# Altium project WSN_Project_Sensor_node.PrjPcb
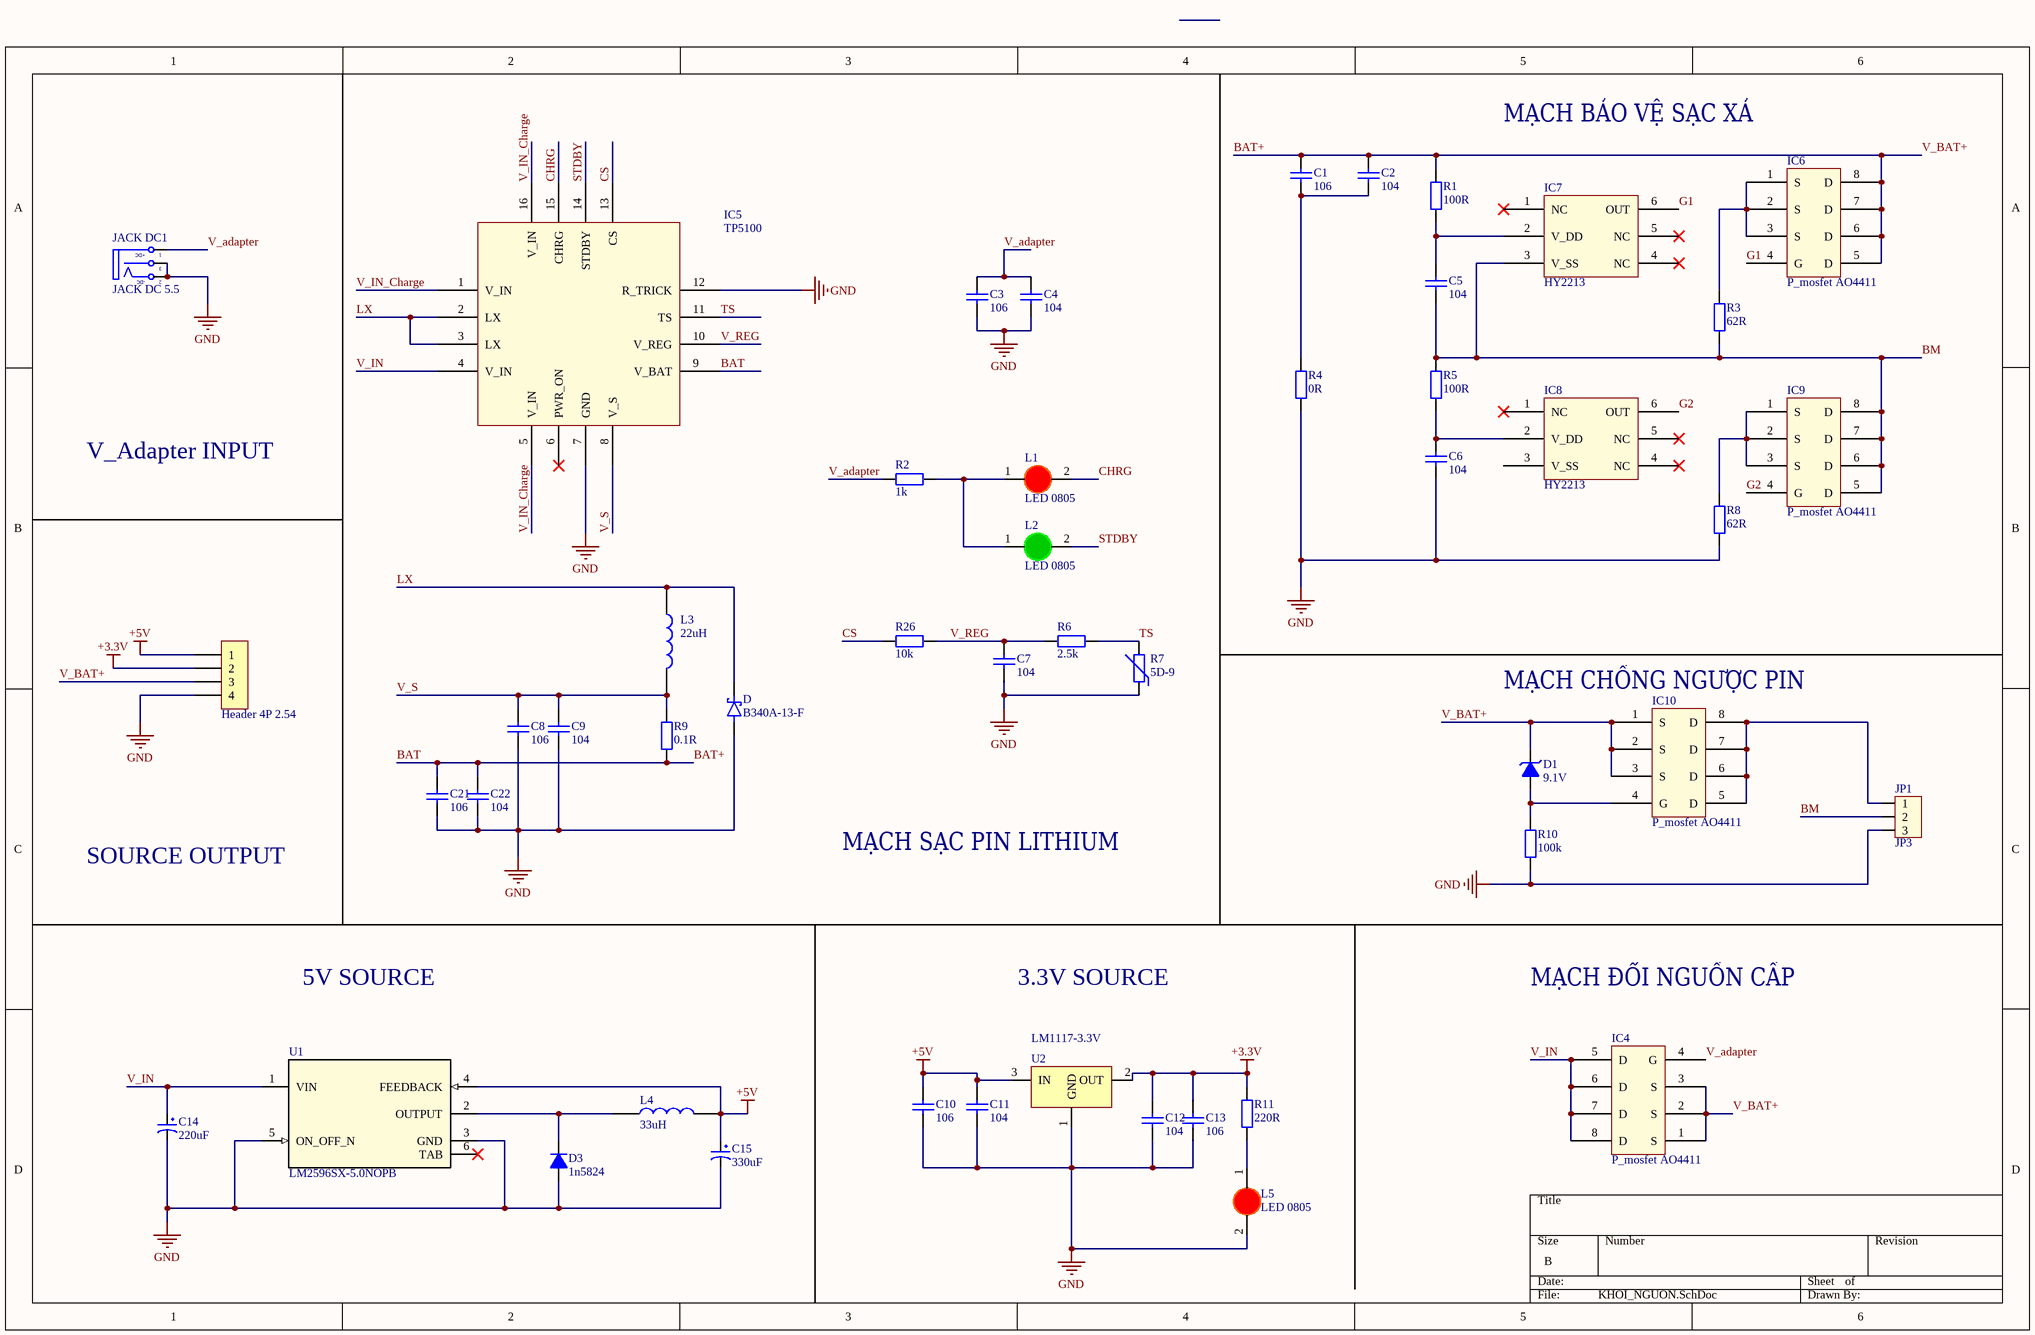
[diagram p0: KHOI_NGUON.SchDoc]
2 sheets, 83 parts. Net scope: global (net labels, ports and power ports of the same name join across sheets).
Sheets:
  KHOI_NGUON.SchDoc
  Sensor_node.SchDoc

## Sheet KHOI_NGUON.SchDoc
size B; SheetNumber: 1; SheetTotal: 2

### Parts
C1  106  [tu 1206]
C2  104  [tu 1206]
C3  106  [tu 1206]
C4  104  [tu 1206]
C5  104  [tu 1206]
C6  104  [tu 1206]
C7  104  [tu 1206]
C8  106  [tu 1206]
C9  104  [tu 1206]
C10  106  [tu 1206]
C11  104  [tu 1206]
C12  104  [tu 1206]
C13  106  [tu 1206]
C14  220uF  [tu hoa 6.5mm]
C15  330uF  [tu hoa 10mm]
C21  106  [tu 1206]
C22  104  [tu 1206]
D  B340A-13-F  [DIOM5226X240N]
D1  9.1V  [DIODE ZENNER SMD SOD80]
D3  1n5824  [DIODE 1A]
H1  Header 4P 2.54  [XH2.54M-4]
IC4  P_mosfet AO4411  [SOIC8_AO4411]
IC5  TP5100  [QFN_16_4*4]
IC6  P_mosfet AO4411  [SOIC8_AO4411]
IC7  HY2213  [SOT_23_6_HY2213]
IC8  HY2213  [SOT_23_6_HY2213]
IC9  P_mosfet AO4411  [SOIC8_AO4411]
IC10  P_mosfet AO4411  [SOIC8_AO4411]
JACK_DC1  JACK DC 5.5  [JACK DC 5.5]
JP1  JP3  [CON3]
L1  LED 0805  [LED-1206-Red]
L2  LED 0805  [LED-1206-Green]
L3  22uH  [Cuon Cam 12x12x10]
L4  33uH  [Cuon Cam 12x12x10]
L5  LED 0805  [LED-0805-Red]
R1  100R  [tro smd 0805]
R2  1k  [tro smd 0805]
R3  62R  [tro smd 0805]
R4  0R  [tro smd 0805]
R5  100R  [tro smd 0805]
R6  2.5k  [tro smd 0805]
R7  5D-9  [tro nhiet d-9]
R8  62R  [tro smd 0805]
R9  0.1R  [tro smd 2512]
R10  100k  [tro smd 0805]
R11  220R  [tro smd 0805]
R26  10k  [tro smd 0805]
U1  LM2596SX-5.0NOPB  [KTT0005B]
U2  LM1117-3.3V  [LM1117-SOP]

### Nets
+3.3V: C12.1 C13.2 H1.2 R11.1 U2.2(OUT)
+5V: C10.2 C11.1 C15.1 H1.1 L4.2 U1.4(FEEDBACK) U2.3(IN)
GND: C3.1 C4.2 C6.2 C7.2 C8.1 C9.2 C10.1 C11.2 C12.2 C13.1 C14.2 C15.2 C21.1 C22.2 D.A D3.1(A) H1.4 IC5.7(GND) IC5.12(R_TRICK) JACK_DC1.2(TN) JACK_DC1.3(S) JP1.3 L5.2(K) R4.1 R7.1 R8.1 R10.1 U1.3(GND) U1.5(ON_OFF_N) U2.1(GND)
BAT: C1.2 C2.1 C21.2 C22.1 D1.2(K) H1.3 IC4.1(S) IC4.2(S) IC4.3(S) IC5.9(V_BAT) IC6.5(D) IC6.6(D) IC6.7(D) IC6.8(D) IC10.1(S) IC10.2(S) IC10.3(S) R1.2 R9.1  [also labelled BAT+, V_BAT+]
BM: C5.2 IC7.3(V_SS) IC9.5(D) IC9.6(D) IC9.7(D) IC9.8(D) JP1.2 R3.1 R5.2
CHRG: IC5.15(CHRG) L1.2(K)
CS: IC5.13(CS) R26.2
G1: IC6.4(G) IC7.6(OUT)
G2: IC8.6(OUT) IC9.4(G)
LX: D.C IC5.2(LX) IC5.3(LX) L3.1
STDBY: IC5.14(STDBY) L2.2(K)
TS: IC5.11(TS) R6.2 R7.2
V_adapter: C3.2 C4.1 IC4.4(G) JACK_DC1.1(T) R2.2
V_IN: C14.1 IC4.5(D) IC4.6(D) IC4.7(D) IC4.8(D) IC5.4(V_IN) U1.1(VIN)
V_IN_Charge: IC5.1(V_IN) IC5.5(V_IN) IC5.16(V_IN)
V_REG: C7.1 IC5.10(V_REG) R6.1 R26.1
V_S: C8.2 C9.1 IC5.8(V_S) L3.2 R9.2
NetC1_1: C1.1 C2.2 R4.2
NetC5_1: C5.1 IC7.2(V_DD) R1.1
NetC6_1: C6.1 IC8.2(V_DD) R5.1
NetD1_1: D1.1(A) IC10.4(G) R10.2
NetD3_2: D3.2(K) L4.1 U1.2(OUTPUT)
NetIC6_1: IC6.1(S) IC6.2(S) IC6.3(S) R3.2
NetIC9_1: IC9.1(S) IC9.2(S) IC9.3(S) R8.2
NetIC10_5: IC10.5(D) IC10.6(D) IC10.7(D) IC10.8(D) JP1.1
NetL1_1: L1.1(A) L2.1(A) R2.1
NetL5_1: L5.1(A) R11.2

Not connected (* = marked no-connect by the designer): IC5 6(PWR_ON)*; IC7 1(NC)* 4(NC)* 5(NC)*; IC8 1(NC)* 3(V_SS) 4(NC)* 5(NC)*; U1 6(TAB)*

### Notes on the sheet
- MẠCH BẢO VỆ SẠC XẢ
- V_Adapter INPUT
- (near IC10) MẠCH CHỐNG NGƯỢC PIN
- SOURCE OUTPUT
- MẠCH SẠC PIN LITHIUM
- 5V SOURCE
- 3.3V SOURCE
- MẠCH ĐỔI NGUỒN CẤP
- (in symbol JACK DC 5.5) +DC; -DC

### Library data of the parts
C1 C3 C8 C10 C13 C21 = Tu 1206 106 16V 20%: Dán; Don_Vi: Con; So_Chan: 2; Ten_Linh_Kien: Tụ 1206 106-10uF 20% 16V; Ma_Hang: MH004541; Chung_Loai: Dán; Kieu_Chan: *
C2 C4-C7 C9 C11 C12 C22 = Tu 1206 104 50V 20%: Dán; Don_Vi: Con; So_Chan: 2; Ten_Linh_Kien: Tụ 1206 104-0.1uF 20% 50V; Ma_Hang: MH004544; Chung_Loai: Dán; Kieu_Chan: *
C14 = Tu Hoa 220uF 16V 7x11: Cắm; Don_Vi: Con; Ten_Linh_Kien: Tụ Hóa 220uF 16V 7x11MM; So_Chan: 2; Ma_Hang: MH008416; Chung_Loai: Cắm; Kieu_Chan: *
C15 = Tu Hoa 330uF 35V 10x12: Cắm; So_Chan: 2; Don_Vi: Con; Ten_Linh_Kien: Tụ Hóa 330uF 35V 10x12MM; Ma_Hang: MH004802; Chung_Loai: Cắm; Kieu_Chan: *
D = B340A-13-F: Diode Schottky 40V 3A Surface Mount SMA; MF: Diodes Inc.; Availability: Unavailable; MP: B340A-13-F; Price: None; Value: *; SnapEDA_Link: https://www.snapeda.com/parts/B340A-13-F/Diodes%20Inc./view-part/78704/?ref=snap; Package: DO-214 Diodes Inc.
D1 = Diode Zener 9.1V: Dán; Don_Vi: Con; Ma_Hang: MH002882; Ten_Linh_Kien: Diode Zener 1/2W 9.1V SMD1206 ZMM9.1; Ghi_Chu: *; Chung_Loai: Dán; Kieu_Chan: *
D3 = Diode 1N4007: Cắm; Ten_Linh_Kien: Diode 1N4007 1A (DIP); Don_Vi: Con; Ma_Hang: MH001063; Ghi Chu: *; Kieu_Chan: *; Chung_Loai: Cắm
H1 = Header 4P 2.54 Duc Thang: Cắm; Ten_Linh_Kien: Header 4P XH2.54-4P Đực Thẳng; Don_Vi: Con; Ma_Hang: MH001285; Chung_Loai: Cắm
IC5 = TP5100: IC sạc pin Lithium
JACK_DC1 = JACK DC 5.5: Value: Jac DC
JP1 = Con3: Connector 3; Value: Connector 3
L1 = LED 1206 Do: Dán; Don_Vi: Con; Ma_Hang: MH002334; Ten_Linh_Kien: LED1206 Màu Đỏ (Red); Ghi_Chu: *; Kieu_Chan: *; Chung_Loai: Dán
L2 = LED 1206 Xanh La: Dán; Don_Vi: Con; Ma_Hang: MH002947; Ten_Linh_Kien: LED1206 Màu Xanh Lá (Green); Ghi_Chu: *; Kieu_Chan: *; Chung_Loai: Dán
L3 L4 = CUON CAM 100uH SMD: Dán; Don_Vi: Con; Ma_Hang: MH003999; Ten_Linh_Kien: Cuộn Cảm 100uH 7x7x4MM CD74; Ma_Hang: *; Kieu_Chan: *; Chung_Loai: Dán
L5 = LED 0805 Do: Dán; Don_Vi: Con; Ma_Hang: MH000897; Ten_Linh_Kien: LED 0805 Màu Đỏ (Red); Ghi_Chu: *; Kieu_Chan: *; Chung_Loai: Dán
R1 R5 = Tro 0805 1% 10R: Dán; Don_Vi: Con; So_Chan: 2; Ten_Linh_Kien: Trở 0805 1% 10R; Ma_Hang: MH005474; Chung_Loai: Dán; Kieu_Chan: *
R2 R26 = Tro 0805 1% 1k: Dán; Don_Vi: Con; So_Chan: 2; Ten_Linh_Kien: Trở 0805 1% 1k; Ma_Hang: MH005468; Chung_Loai: Dán; Kieu_Chan: *
R3 R8 = Tro 0805 5% 62R: Dán; Don_Vi: Con; So_Chan: 2; Ten_Linh_Kien: Trở 0805 5% 62R; Ma_Hang: MH005324; Chung_Loai: Dán; Kieu_Chan: *
R4 = Tro 0805 5% 0R: Dán; Don_Vi: Con; So_Chan: 2; Ten_Linh_Kien: Trở 0805 5% 0R; Ma_Hang: MH005230; Chung_Loai: Dán; Kieu_Chan: *
R6 = Tro 0805 5% 2.7k: Dán; Don_Vi: Con; So_Chan: 2; Ten_Linh_Kien: Trở 0805 5% 2.7k; Ma_Hang: MH005238; Chung_Loai: Dán; Kieu_Chan: *
R7 = Tro Nhiet NTC 5D-9: Cắm; So_Chan: 2; Don_Vi: Con; Ten_Linh_Kien: Điện Trở Nhiệt NTC 5D-9; Ma_Hang: MH005857; Chung_Loai: Cắm; Kieu_Chan: *
R9 = Tro 2512 5% 0.1R: Dán; Don_Vi: Con; So_Chan: 2; Ten_Linh_Kien: Trở 2512 5% 0.1R 1W; Ma_Hang: MH004711; Chung_Loai: Dán; Kieu_Chan: *
R10 = Tro 0805 5% 100k: Dán; Don_Vi: Con; So_Chan: 2; Ten_Linh_Kien: Trở 0805 5% 100k; Ma_Hang: MH005250; Chung_Loai: Dán; Kieu_Chan: *
R11 = Tro 0805 1% 0.5R: Dán; Don_Vi: Con; So_Chan: 2; Ten_Linh_Kien: Trở 0805 1% 0.5R; Ma_Hang: MH005465; Chung_Loai: Dán; Kieu_Chan: *
U1 = LM2596SX-5.0NOPB: No Description Available; Mfr_Name: Texas Instruments; PartNumber: LM2596SX-ADJ/NOPB; Alternate_PartNumber: LM2596S-ADJ/NOPB; CompType: IC; TYPE: TYPE; RefDes: RefDes; PackageReference: KTT0005B; MountType: SMT; RoHS: Y; Manufacturer: Texas Instruments
U2 = LM1117: 800mA Low-Dropout Linear Regulator; Creator: Nguyen Ba Bien; Website: http://group3i.net

## Sheet Sensor_node.SchDoc
size A4; SheetNumber: 2; SheetTotal: 2
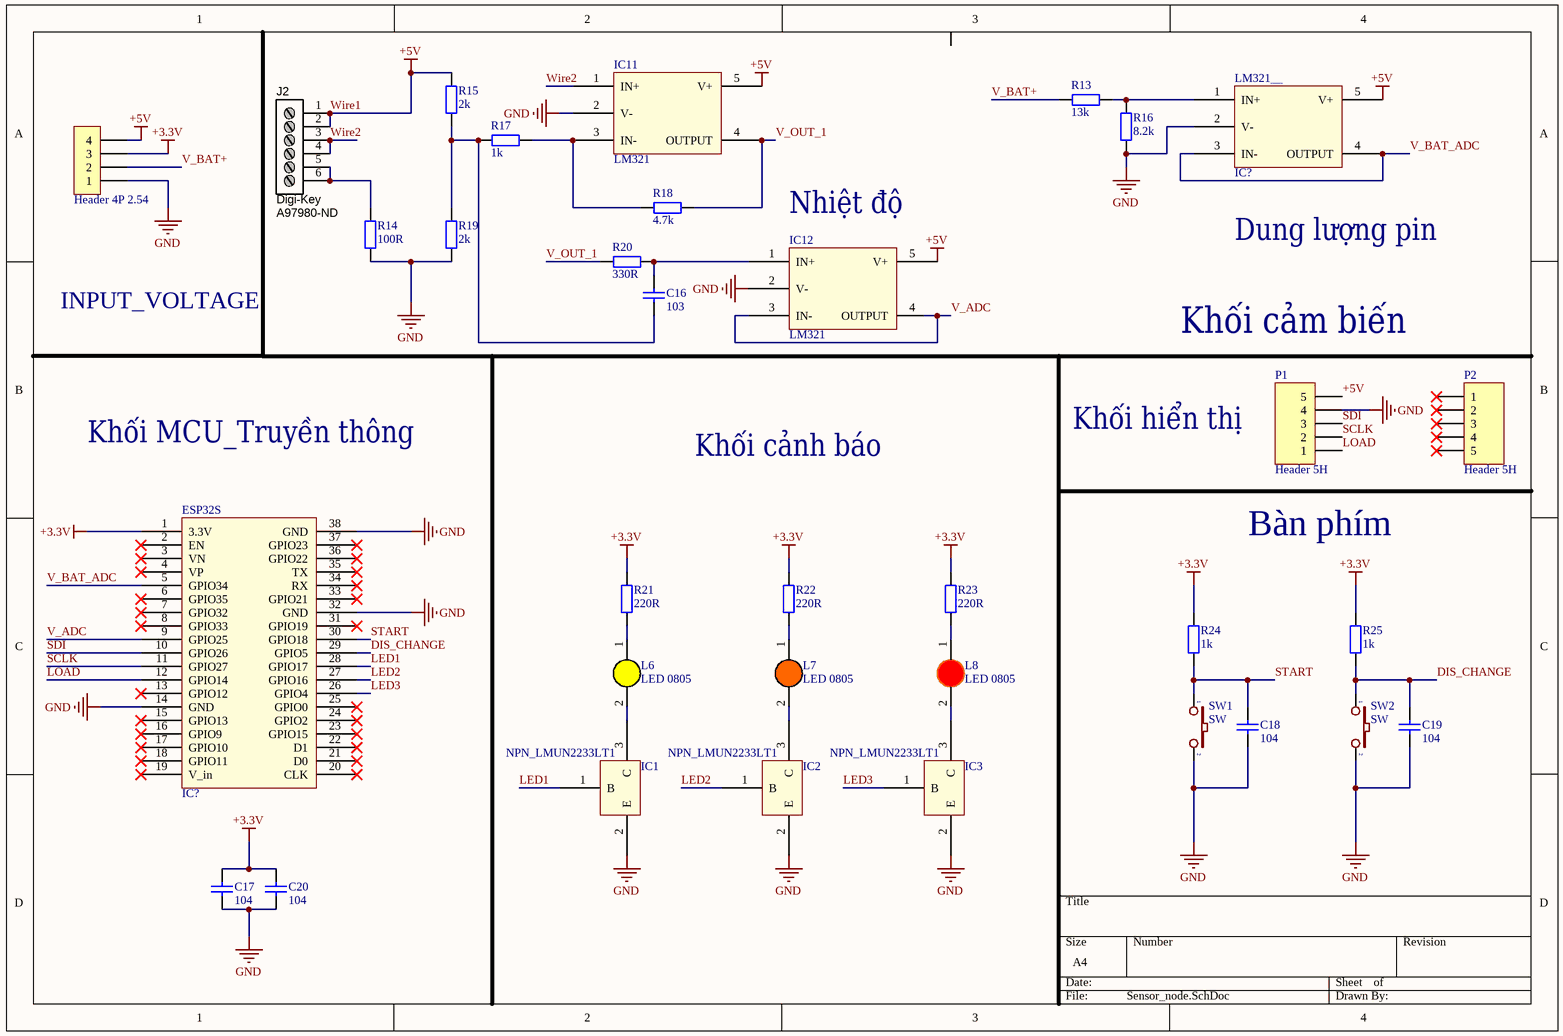
[diagram p1: Sensor_node.SchDoc]

### Parts
C16  103  [tu gom]
C17  104  [tu 1206]
C18  104  [tu gom]
C19  104  [tu gom]
C20  104  [tu 1206]
ESP32S  IC?  [ESP32 DEVKIT]
H2  Header 4P 2.54  [XH2.54M-4]
IC1  NPN_LMUN2233LT1  [SOT23_LMUN2233_trans]
IC2  NPN_LMUN2233LT1  [SOT23_LMUN2233_trans]
IC3  NPN_LMUN2233LT1  [SOT23_LMUN2233_trans]
IC11  LM321  [SOT23_LM321]
IC12  LM321  [SOT23_LM321]
J2  Supplier 1: Digi-Key  Supplier Part Number 1: A97980-ND  [6P_PCB_ScrewTerm_90S_3.81MM]  (hidden comment: Stackable ScrewTerm)
L6  LED 0805  [LED-0805-Yellow]
L7  LED 0805  [LED-0805-Orange]
L8  LED 0805  [LED-0805-Red]
LM321__  IC?  [SOT23_LM321]
P1  Header 5H  [HDR1X5H]
P2  Header 5H  [HDR1X5H]
R13  13k  [tro smd 0805]
R14  100R  [tro smd 1206]
R15  2k  [tro smd 1206]
R16  8.2k  [tro smd 0805]
R17  1k  [tro smd 0805]
R18  4.7k  [tro smd 0805]
R19  2k  [tro smd 1206]
R20  330R  [Tro SMD 0805]
R21  220R  [tro smd 0805]
R22  220R  [tro smd 0805]
R23  220R  [tro smd 0805]
R24  1k  [tro smd 0805]
R25  1k  [tro smd 0805]
SW1  SW  [SW2]
SW2  SW  [SW2]

### Nets
+3.3V: C17.1 C20.1 ESP32S.1(3.3V) H2.3 R21.2 R22.2 R23.2 R24.2 R25.2
+5V: H2.4 IC11.5(V+) IC12.5(V+) J2.1 J2.2 LM321__.5(V+) P1.5 R15.2  [also labelled Wire1]
GND: C17.2 C18.2 C19.2 C20.2 ESP32S.14(GND) ESP32S.32(GND) ESP32S.38(GND) H2.1 IC1.2(E) IC2.2(E) IC3.2(E) IC11.2(V-) IC12.2(V-) LM321__.2(V-) P1.4 R14.1 R16.1 R19.1 SW1.2 SW2.2
DIS_CHANGE: C19.1 ESP32S.29(GPIO5) R25.1 SW2.1
LED1: ESP32S.28(GPIO17) IC1.1(B)
LED2: ESP32S.27(GPIO16) IC2.1(B)
LED3: ESP32S.26(GPIO4) IC3.1(B)
LOAD: ESP32S.12(GPIO14) P1.1
SCLK: ESP32S.11(GPIO27) P1.2
SDI: ESP32S.10(GPIO26) P1.3
START: C18.1 ESP32S.30(GPIO18) R24.1 SW1.1
V_ADC: ESP32S.9(GPIO25) IC12.3(IN-) IC12.4(OUTPUT)
V_BAT+: H2.2 R13.1  [project net BAT]
V_BAT_ADC: ESP32S.5(GPIO34) LM321__.3(IN-) LM321__.4(OUTPUT)
V_OUT_1: IC11.4(OUTPUT) R18.2 R20.1
Wire2: IC11.1(IN+) J2.3 J2.4
NetC16_1: C16.1 IC12.1(IN+) R20.2
NetC16_2: C16.2 R15.1 R17.1 R19.2
NetIC1_3: IC1.3(C) L6.2(K)
NetIC2_3: IC2.3(C) L7.2(K)
NetIC3_3: IC3.3(C) L8.2(K)
NetIC11_3: IC11.3(IN-) R17.2 R18.1
NetJ2_5: J2.5 J2.6 R14.2
NetL6_1: L6.1(A) R21.1
NetL7_1: L7.1(A) R22.1
NetL8_1: L8.1(A) R23.1
NetLM321___1: LM321__.1(IN+) R13.2 R16.2

Not connected (* = marked no-connect by the designer): ESP32S 2(EN)* 3(VN)* 4(VP)* 6(GPIO35)* 7(GPIO32)* 8(GPIO33)* 13(GPIO12)* 15(GPIO13)* 16(GPIO9)* 17(GPIO10)* 18(GPIO11)* 19(V_in)* 20(CLK)* 21(D0)* 22(D1)* 23(GPIO15)* 24(GPIO2)* 25(GPIO0)* 31(GPIO19)* 33(GPIO21)* 34(RX)* 35(TX)* 36(GPIO22)* 37(GPIO23)*; P2 1* 2* 3* 4* 5*

### Notes on the sheet
- (near IC12) Nhiệt độ
- Dung lượng pin
- INPUT_VOLTAGE
- Khối cảm biến
- Khối MCU_Truyền thông
- (near P1) Khối hiển thị
- Khối cảnh báo
- Bàn phím

### Library data of the parts
C16 = Tu gom 103 50V: Cắm; So_Chan: 2; Ten_Linh_Kien: Tụ gốm 103 10nF 50V; Don_Vi: Con; Ma_Hang: MH000936; Chung_Loai: Cắm; Kieu_Chan: *
C17 C20 = Tu 1206 104 50V 20%: as C2 on sheet KHOI_NGUON; Chung_Loai: Dán; Kieu_Chan: *
C18 C19 = Tu gom 104 50V: Cắm; So_Chan: 2; Ten_Linh_Kien: Tụ gốm 104 100nF 50V; Don_Vi: Con; Ma_Hang: MH004761; Chung_Loai: Cắm; Kieu_Chan: *
H2 = Header 4P 2.54 Duc Thang: as H1 on sheet KHOI_NGUON; Chung_Loai: Cắm
J2 = 6P_ScrewTerm_90S_3.81MM: Terminal Block, THT, 6-Position screwterm, 3.81mm pitch; Manufacturer 1: Tyco Electronics; Manufacturer Part Number 1: 1776113-6; Value: 6 position; Pitch: 0.150" (3.81mm); Positions Per Level: 6; SCDType: undef; Package / Case: Side Entry; 3.81mm pitch; Category: Connectors Interconnects; Color: Black
L6 = LED 0805 Vang: Dán; Don_Vi: Con; Ma_Hang: MH002329; Ten_Linh_Kien: LED 0805 Màu Vàng ( Yellow); Ghi_Chu: *; Kieu_Chan: *; Chung_Loai: Dán
L7 = LED 0805 Cam: Dán; Don_Vi: Con; Ma_Hang: MH002328; Ten_Linh_Kien: LED 0805 Màu Cam ( Orange); Ghi_Chu: *; Kieu_Chan: *; Chung_Loai: Dán
L8 = LED 0805 Do: as L5 on sheet KHOI_NGUON; Ghi_Chu: *; Kieu_Chan: *; Chung_Loai: Dán
P1 P2 = Header 5H: Header, 5-Pin, Right Angle; LatestRevisionDate: 17-Jul-2002; LatestRevisionNote: Re-released for DXP Platform.; Publisher: Altium Limited
R13 = Tro 0805 5% 12k: Dán; Don_Vi: Con; So_Chan: 2; Ten_Linh_Kien: Trở 0805 5% 12k; Ma_Hang: MH005241; Chung_Loai: Dán; Kieu_Chan: *
R14 = Tro 1206 5% 100R: Dán; Don_Vi: Con; So_Chan: 2; Ten_Linh_Kien: Trở 1206 5% 100R; Ma_Hang: MH005922; Chung_Loai: Dán; Kieu_Chan: *
R15 R19 = Tro 1206 5% 2k: Dán; Don_Vi: Con; So_Chan: 2; Ten_Linh_Kien: Trở 1206 5% 2k; Ma_Hang: MH005907; Chung_Loai: Dán; Kieu_Chan: *
R16 = Tro 0805 5% 8.2k: Dán; Don_Vi: Con; So_Chan: 2; Ten_Linh_Kien: Trở 0805 5% 8.2k; Ma_Hang: MH005312; Chung_Loai: Dán; Kieu_Chan: *
R17 R24 R25 = Tro 0805 5% 1k: Dán; Don_Vi: Con; So_Chan: 2; Ten_Linh_Kien: Trở 0805 5% 1k; Ma_Hang: MH005234; Chung_Loai: Dán; Kieu_Chan: *
R18 = Tro 0805 5% 4.7k: Dán; Don_Vi: Con; So_Chan: 2; Ten_Linh_Kien: Trở 0805 5% 4.7k; Ma_Hang: MH005307; Chung_Loai: Dán; Kieu_Chan: *
R20 = Tro 0805 5% 330R: Dán; Don_Vi: Con; So_Chan: 2; Ten_Linh_Kien: Trở 0805 5% 330R; Ma_Hang: MH005337; Chung_Loai: Dán; Kieu_Chan: *
R21-R23 = Tro 0805 5% 220R: Dán; Don_Vi: Con; So_Chan: 2; Ten_Linh_Kien: Trở 0805 5% 220R; Ma_Hang: MH005259; Chung_Loai: Dán; Kieu_Chan: *
SW1 SW2 = SW2: Switch button 2 pin; Value: SW chip 2 pin

## Nets that join several sheets
+3.3V: KHOI_NGUON (5 pins), Sensor_node (9 pins)
+5V: KHOI_NGUON (7 pins), Sensor_node (8 pins)
GND: KHOI_NGUON (30 pins), Sensor_node (20 pins)
BAT: KHOI_NGUON (19 pins), Sensor_node (H2.2 R13.1)